# Altium schematic sheet PowerSection.SchDoc: Power Section
size 420 x 297 mm; SheetNumber: 3
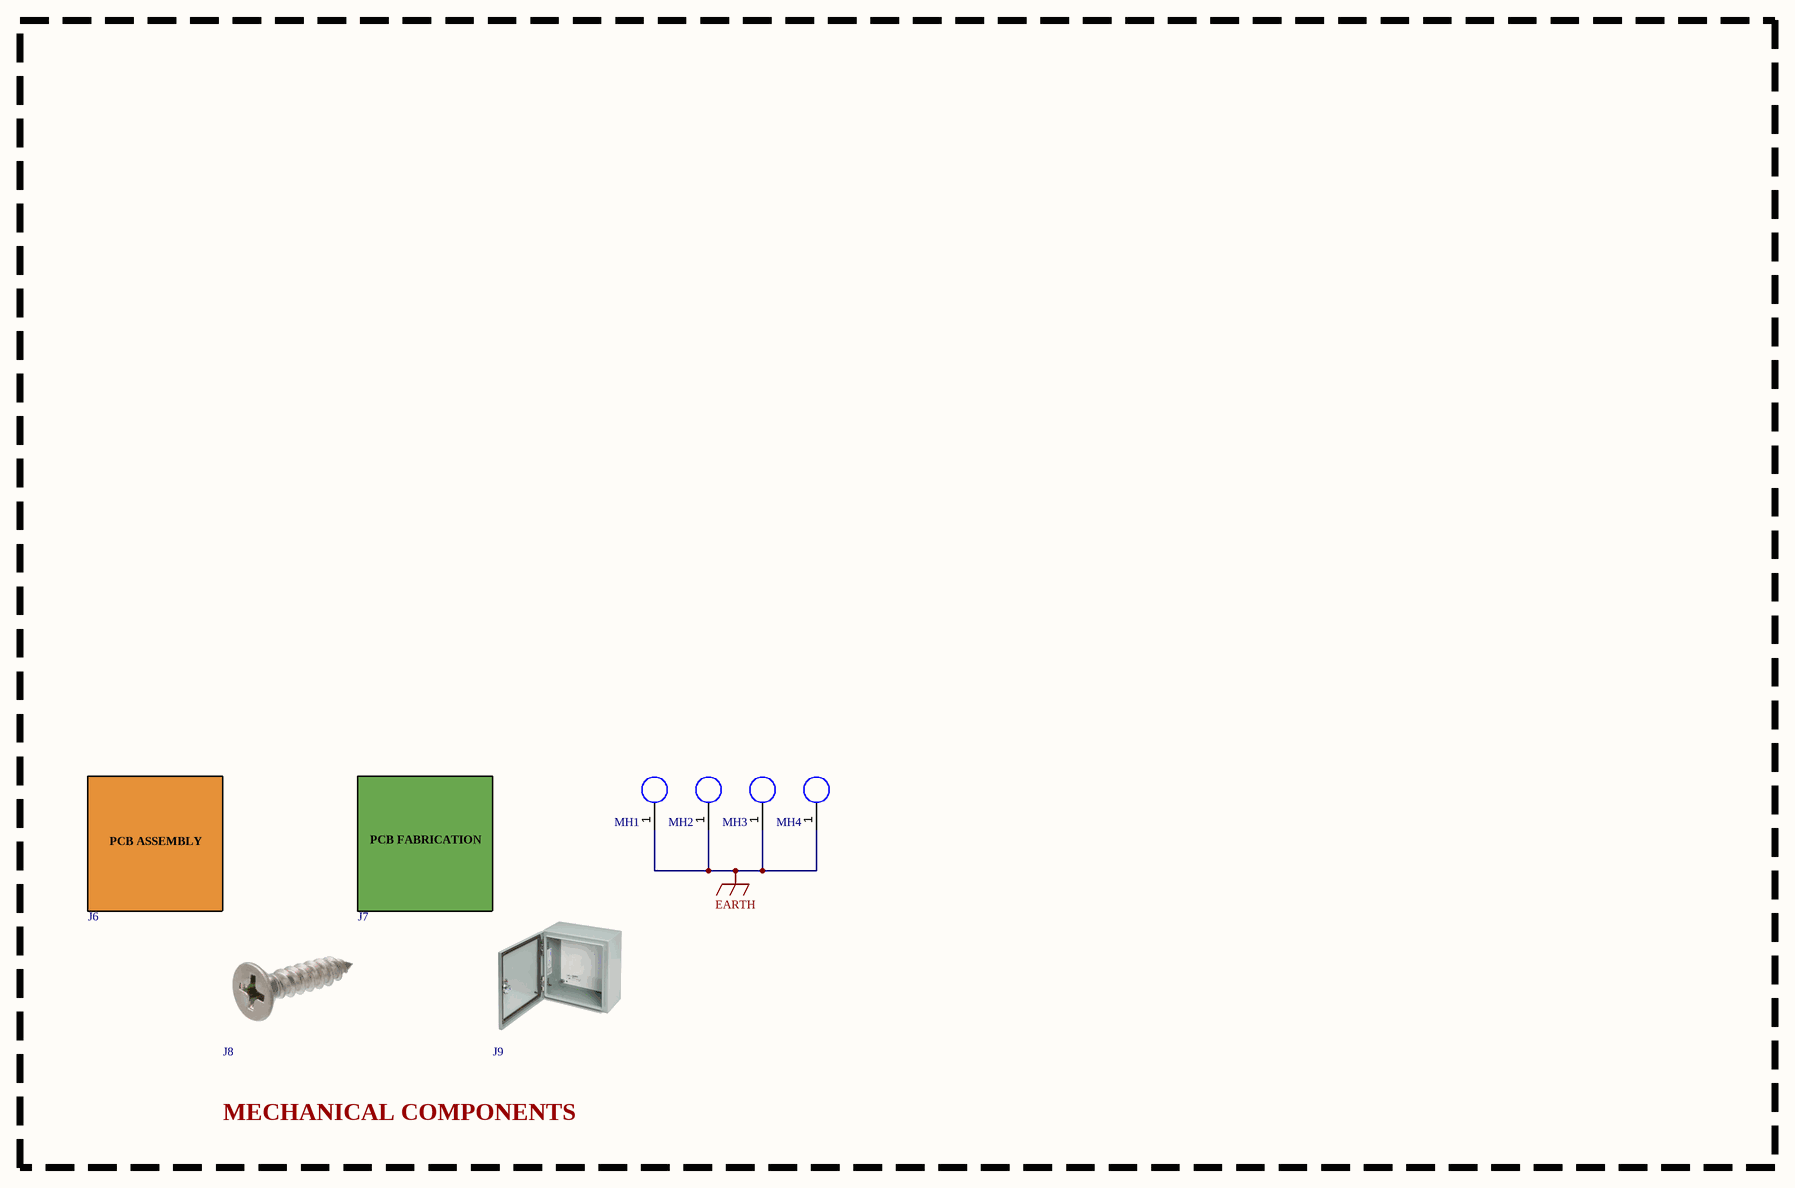
[diagram p0: PowerSection.SchDoc]

## Parts
J6  APCB  (value not drawn)  (graphical)
J7  BPCB  (value not drawn)  (graphical)
J8  SCREW  (value not drawn)  (graphical)
J9  ENCLOSURE  (value not drawn)  (graphical)
MH1  MountingHole4X6  [MountingHole4X6]  (value not drawn)  (no BOM)
MH2  MountingHole4X6  [MountingHole4X6]  (value not drawn)  (no BOM)
MH3  MountingHole4X6  [MountingHole4X6]  (value not drawn)  (no BOM)
MH4  MountingHole4X6  [MountingHole4X6]  (value not drawn)  (no BOM)

## Blocks framed on the sheet
MECHANICAL COMPONENTS: J6-J9 MH1-MH4

## Nets
EARTH: MH1.1 MH2.1 MH3.1 MH4.1

## Notes on the sheet
- PROJECT
- SIZE
- FILE NAME
- A3
- TITLE
- SHEET
- OF
- REV
- (in symbol APCB) PCB ASSEMBLY
- (in symbol BPCB) PCB FABRICATION

## Library data of the parts
J6 = APCB: Assembled PCB; Value: *; Manufacturer 1: *; Manufacturer Part Number 1: *
J7 = BPCB: Bare PCB; Manufacturer Part Number 1: *; Manufacturer 1: *; Value: *
J8 = SCREW: Mounting Screw
J9 = ENCLOSURE: PCB Enclosure; Manufacturer Part Number 1: *; Manufacturer 1: *; Value: *